# Altium schematic sheet 1.SchDoc
size C
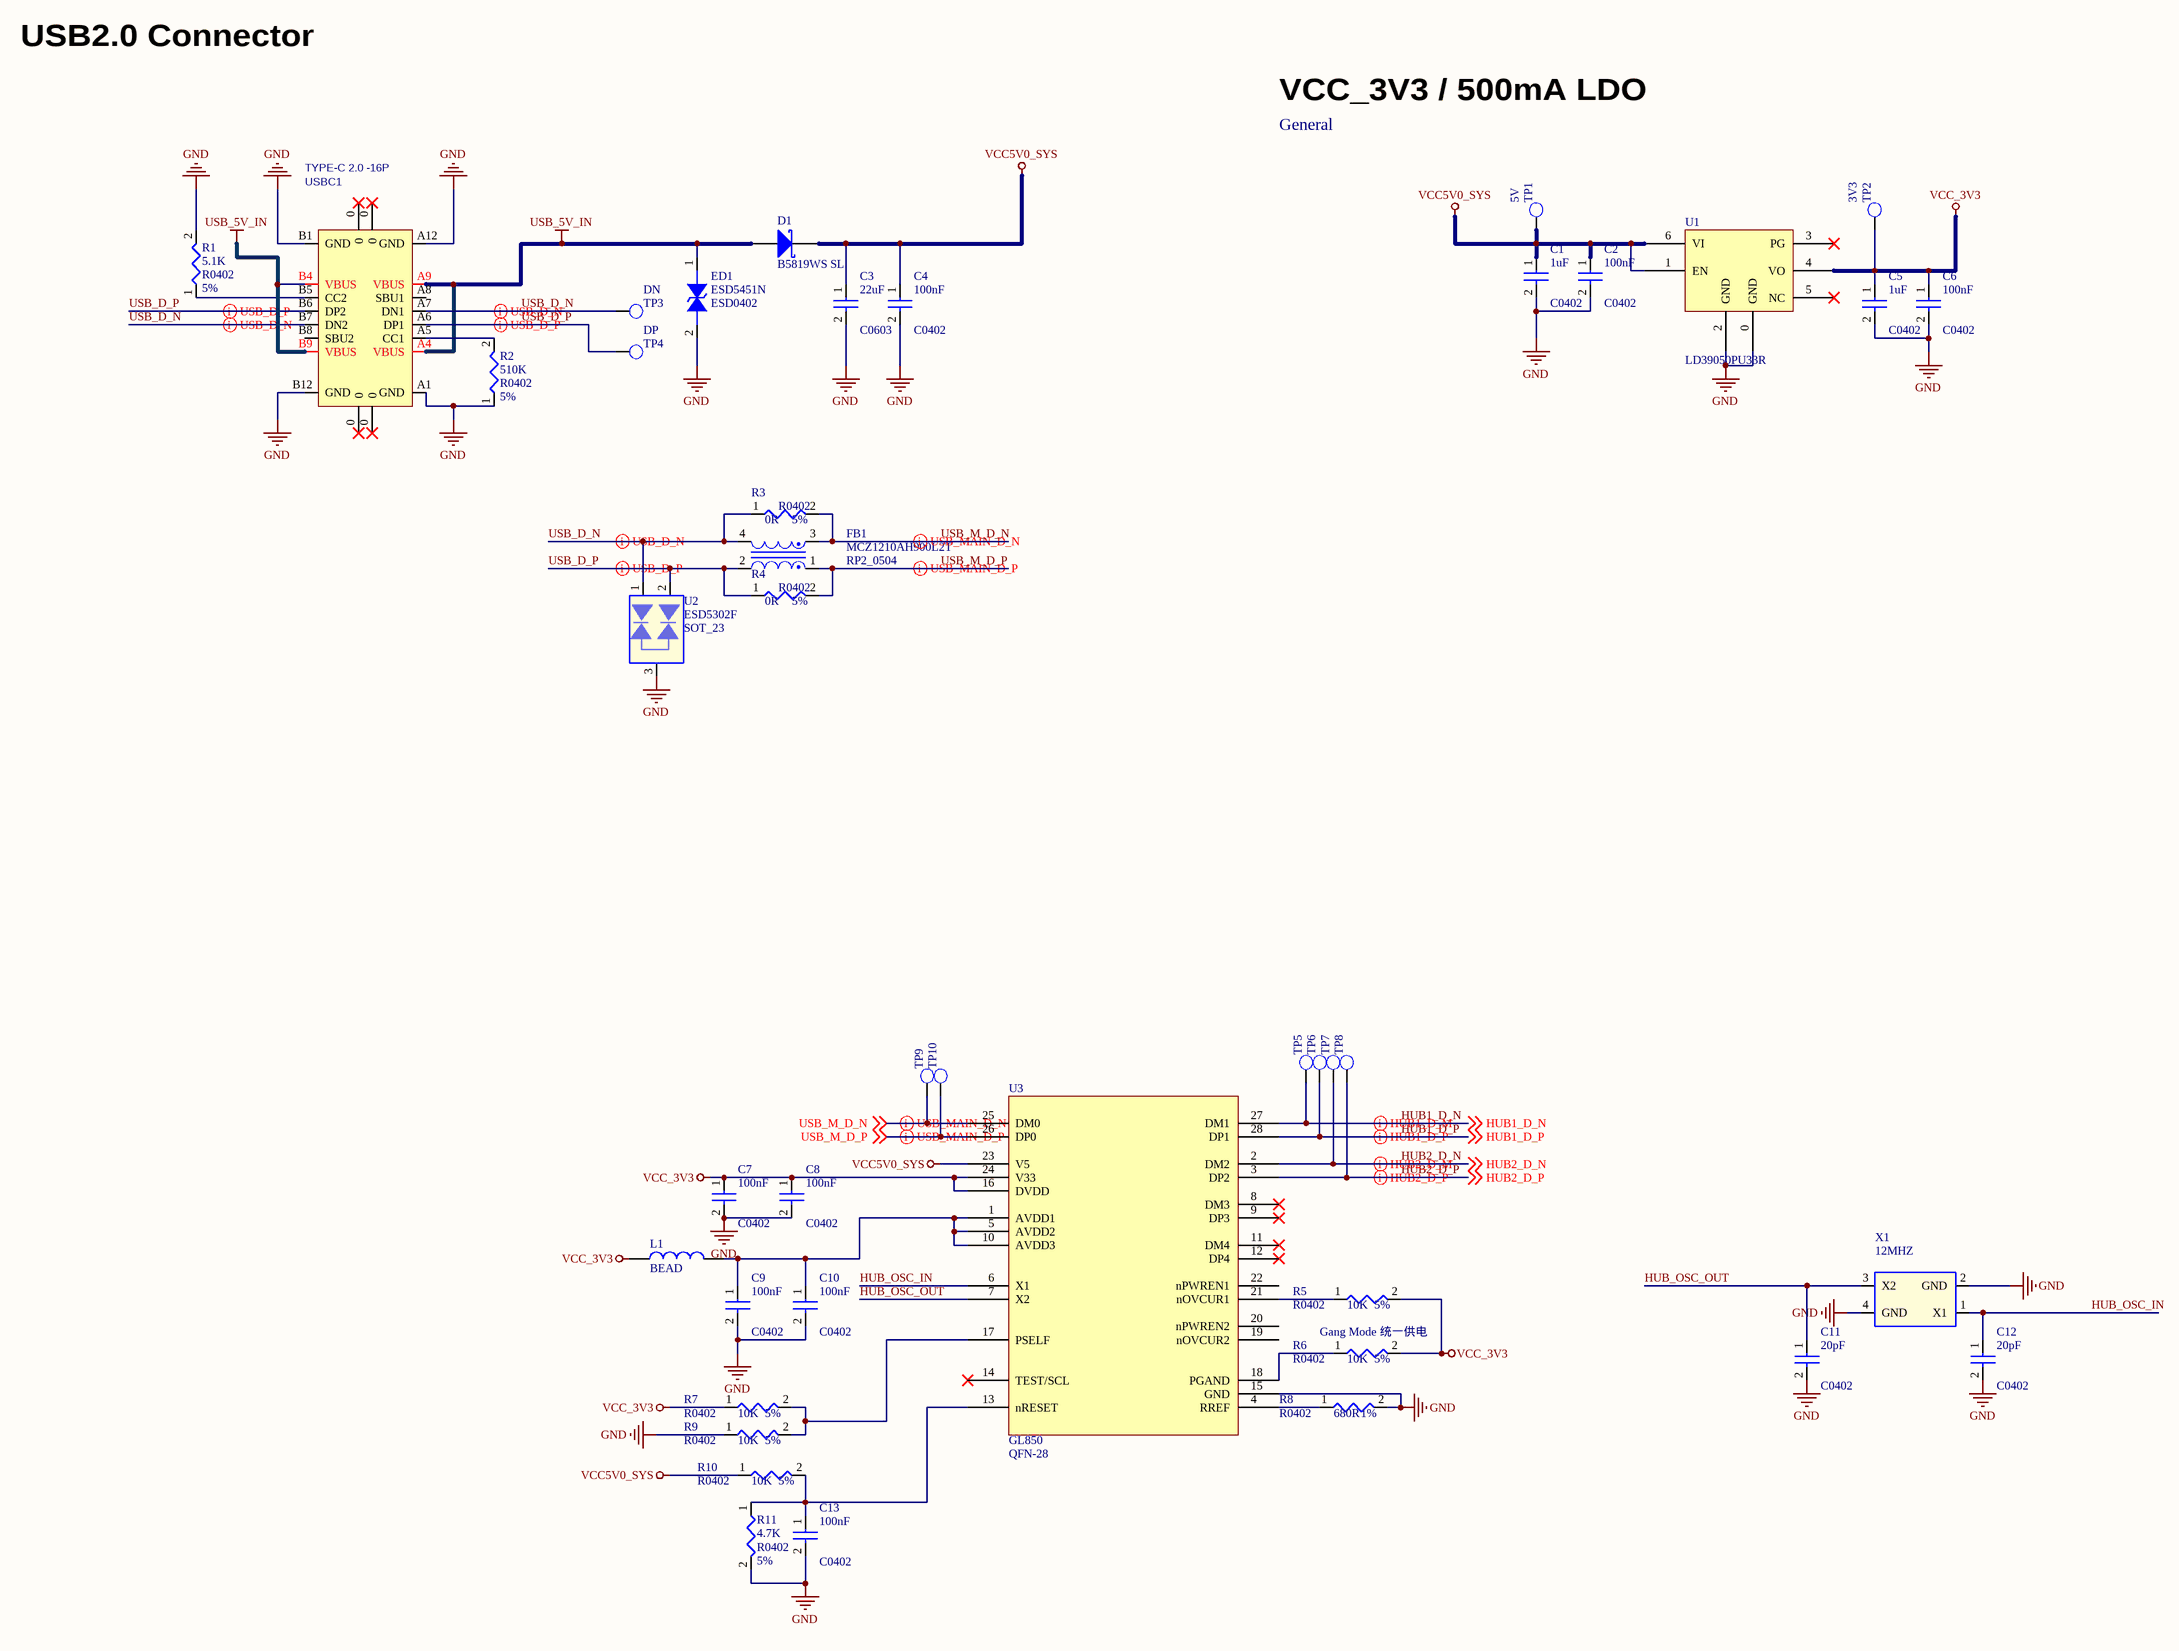
[diagram p0: 1.SchDoc]

## Parts
C1  1uF  PCB Footprint: C0402  [C0402_L]
C2  100nF  PCB Footprint: C0402  [C0402_L]
C3  22uF  PCB Footprint: C0603  [C0603_L]
C4  100nF  PCB Footprint: C0402  [C0402_L]
C5  1uF  PCB Footprint: C0402  [C0402_L]
C6  100nF  PCB Footprint: C0402  [C0402_L]
C7  100nF  PCB Footprint: C0402  [C0402_L]
C8  100nF  PCB Footprint: C0402  [C0402_L]
C9  100nF  PCB Footprint: C0402  [C0402_L]
C10  100nF  PCB Footprint: C0402  [C0402_L]
C11  20pF  PCB Footprint: C0402  [C0402_L]
C12  20pF  PCB Footprint: C0402  [C0402_L]
C13  100nF  PCB Footprint: C0402  [C0402_L]
D1  B5819WS SL  [SOD-323]
ED1  ESD5451N  [ESD0402]
FB1  MCZ1210AH900L2T  PCB Footprint: RP2_0504  [L0402D]  (net tie, no BOM)
L1  BEAD  [L0402]
R1  5.1K  Tolerance: 5%  [R0402]
R2  510K  Tolerance: 5%  [R0402]
R3  0R  Tolerance: 5%  [R0402]
R4  0R  Tolerance: 5%  [R0402]
R5  10K  Tolerance: 5%  [R0402]
R6  10K  Tolerance: 5%  [R0402]
R7  10K  Tolerance: 5%  [R0402]
R8  680R  Tolerance: 1%  [R0402]
R9  10K  Tolerance: 5%  [R0402]
R10  10K  Tolerance: 5%  [R0402]
R11  4.7K  Tolerance: 5%  [R0402]
TP1  5V  [TP_0R70]  (no BOM)
TP2  3V3  [TP_0R70]  (no BOM)
TP3  DN  [TP_0R70]  (no BOM)
TP4  DP  [TP_0R70]  (no BOM)
TP5  (no value)  [TP_0R70]  (no BOM)
TP6  (no value)  [TP_0R70]  (no BOM)
TP7  (no value)  [TP_0R70]  (no BOM)
TP8  (no value)  [TP_0R70]  (no BOM)
TP9  (no value)  [TP_0R70]  (no BOM)
TP10  (no value)  [TP_0R70]  (no BOM)
U1  LD39050PU33R  [SON95P300X300X100-7N]
U2  ESD5302F  PCB Footprint: SOT_23  [SOT23]
U3  GL850  [QFN-28]
USBC1  TYPE-C 2.0 -16P  [USB-C-SMD_16P]
X1  12MHZ  [XTAL_3225]

## Nets
GND: C1.2 C2.2 C3.2 C4.2 C5.2 C6.2 C7.2 C8.2 C9.2 C10.2 C11.2 C12.2 C13.2 ED1.2 R1.2 R2.1 R8.2 R9.1 R11.2 U1.0(GND) U1.2(GND) U2.3 U3.15(GND) USBC1.A1(GND) USBC1.A12(GND) USBC1.B1(GND) USBC1.B12(GND) X1.2(GND) X1.4(GND)
USB_5V_IN: D1.1(A) ED1.1 USBC1.A4(VBUS) USBC1.A9(VBUS) USBC1.B4(VBUS) USBC1.B9(VBUS)
VCC5V0_SYS: C1.1 C2.1 C3.1 C4.1 D1.2(K) R10.1 TP1.1 U1.1(EN) U1.6(VI) U3.23(V5)
VCC_3V3: C5.1 C6.1 C7.1 C8.1 L1.1 R5.2 R6.2 R7.1 TP2.1 U1.4(VO) U3.16(DVDD) U3.24(V33)
HUB1_D_N: TP5.1 U3.27(DM1) ; off-sheet HUB1_D_N
HUB1_D_P: TP6.1 U3.28(DP1) ; off-sheet HUB1_D_P
HUB2_D_N: TP7.1 U3.2(DM2) ; off-sheet HUB2_D_N
HUB2_D_P: TP8.1 U3.3(DP2) ; off-sheet HUB2_D_P
HUB_OSC_IN: C12.1 U3.6(X1) X1.1(X1)
HUB_OSC_OUT: C11.1 U3.7(X2) X1.3(X2)
USB_D_N: FB1.4 R3.1 TP3.1 U2.1 USBC1.A7(DN1) USBC1.B7(DN2)
USB_D_P: FB1.2 R4.1 TP4.1 U2.2 USBC1.A6(DP1) USBC1.B6(DP2)
USB_M_D_N: FB1.3 R3.2 TP9.1 U3.25(DM0) ; off-sheet USB_M_D_N
USB_M_D_P: FB1.1 R4.2 TP10.1 U3.26(DP0) ; off-sheet USB_M_D_P
NetC9_1: C9.1 C10.1 L1.2 U3.1(AVDD1) U3.5(AVDD2) U3.10(AVDD3)
NetC13_1: C13.1 R10.2 R11.1 U3.13(nRESET)
NetR1_1: R1.1 USBC1.B5(CC2)
NetR2_2: R2.2 USBC1.A5(CC1)
NetR5_1: R5.1 U3.21(nOVCUR1)
NetR6_1: R6.1 U3.18(PGAND)
NetR7_2: R7.2 R9.2 U3.17(PSELF)
NetR8_1: R8.1 U3.4(RREF)

Not connected (* = marked no-connect by the designer): U1 3(PG)* 5(NC)*; U3 8(DM3)* 9(DP3)* 11(DM4)* 12(DP4)* 14(TEST/SCL)* 19(nOVCUR2) 20(nPWREN2) 22(nPWREN1); USBC1 0* A8(SBU1) B8(SBU2)

## Layout directives
differential pair; differential pair class USB: HUB1_D_N, HUB1_D_P, HUB2_D_N, HUB2_D_P, USB_D_N, USB_D_P, USB_M_D_N, USB_M_D_P
differential pair; differential pair class USB; net class USB: USB_D_N, USB_D_P

## Notes on the sheet
- USB2.0 Connector
- VCC_3V3 / 500mA LDO
- General
- (near R6) Gang Mode 统一供电

## Library data of the parts
C1 C5 = CAP NP_Dup1: cap,1.0uF,+/-10%,6.3V,X5R,C0402; Manufacturer_Name: Open/Any; Priority: A; Part Type: Capacitor; Package: 0402; Manufacturer_Part_Number: Open/Any
C2 C6 = CAP NP_Dup1: cap,1.0uF,+/-10%,6.3V,C0402; Manufacturer_Name: Open/Any; Priority: A; Part Type: Capacitor; Package: 0402; Manufacturer_Part_Number: Open/Any
C3 = CAP NP_Dup1: cap,22.00uF,+/-10%,10V,X5R,C0603; Manufacturer_Name: Open/Any; Priority: A; Part Type: Capacitor; Package: 0603; Manufacturer_Part_Number: Open/Any
C4 C7-C10 C13 = CAP NP_Dup1: cap,100.00nF,+/-10%,10V,X5R,C0402; Manufacturer_Name: Open/Any; Priority: A; Part Type: Capacitor; Package: 0402; Manufacturer_Part_Number: Open/Any
C11 C12 = CAP NP_Dup1: cap,20pF,+/-10%,25V,X5R,C0402; Manufacturer_Name: Open/Any; Priority: A; Part Type: Capacitor; Package: 0402; Manufacturer_Part_Number: Open/Any
D1 = SS14: B5819WS SL 肖特基二极管 / SOD-323; Manufacturer_Name: MDD; Part Type: Diode; Package: SOD-323; Manufacturer_Part_Number: B5819WS SL
ED1 = DIODE BI_DIR TRIG: 1-Line, Bi-directional, Transient Voltage Suppressors.17.5pF.; Manufacturer_Name: Will Semiconductor Ltd.; Priority: A; PCB Footprint: ESD0402; Part Type: ESD_TVS; Manufacturer_Part_Number: ESD5451N; Package: 0402
FB1 = INDUCTOR COM: MCZ1210AH900L2T, 0603 90Ohm 100MHz; Manufacturer_Name: TDK; Priority: A; Part Type: BEAD; Manufacturer_Part_Number: MCZ1210AH900L2T; Package: 0504
L1 = L-AL: 鐵氧體磁珠 33ohm 0.55A 550mOhms 0402 Chip Bead; Manufacturer_Name: TDK; Manufacturer_Part_Number: MPZ0402S330CTF0W; PCB Footprint: 0402; Part Type: BEAD; Package: 0402
R1 = RESISTOR: 通用厚膜电阻,5.1K,+/-5%,R0402; Manufacturer_Name: Open/Any; Priority: A; PCB Footprint: R0402; Part Type: Resistor; Package: 0402; Manufacturer_Part_Number: Open/Any
R2 = RESISTOR: 通用厚膜电阻,510K,+/-1%,R0402; Manufacturer_Name: Open/Any; Priority: A; PCB Footprint: R0402; Part Type: Resistor; Package: 0402; Manufacturer_Part_Number: Open/Any
R3 R4 = RESISTOR: 通用厚膜电阻,0R,+/-5%,R0402; Manufacturer_Name: Open/Any; Priority: A; PCB Footprint: R0402; Part Type: Resistor; Package: 0402; Manufacturer_Part_Number: Open/Any
R5-R7 R9 R10 = RESISTOR: 通用厚膜电阻,10K,+/-5%,R0402; Manufacturer_Name: Open/Any; Priority: A; PCB Footprint: R0402; Part Type: Resistor; Package: 0402; Manufacturer_Part_Number: Open/Any
R8 = RESISTOR: 通用厚膜电阻,680R,+/-1%,R0402; Manufacturer_Name: Open/Any; Priority: A; PCB Footprint: R0402; Part Type: Resistor; Package: 0402; Manufacturer_Part_Number: Open/Any
R11 = RESISTOR: 通用厚膜电阻,4.7K,+/-5%,R0402; Manufacturer_Name: Open/Any; Priority: A; PCB Footprint: R0402; Part Type: Resistor; Package: 0402; Manufacturer_Part_Number: Open/Any
TP1-TP10 = TP: Test Point 0.7mm; PCB Footprint: TP_0R50; Priority: A; Part Type: TP
U1 = LD39050PU33R: LD39050PU33R / 6-DFN (3x3) / Output 500mA; Manufacturer_Name: STMicroelectronics; PCB Footprint: DFN-6; Manufacturer_Part_Number: LD39050PU33R; Package: DFN-6; Part Type: LDO
U2 = ESD_ESDA6V8UL: 2-Lines, Uni-directional,Ultra-low Capacitance.Transient Voltage Suppressors; Manufacturer_Name: Will Semiconductor Ltd.; Priority: A; Part Type: ESD_TVS; Manufacturer_Part_Number: ESD5302F; Package: SOT-23
U3 = GL850G: GL850 4 Port USB HUB QFN-28; Manufacturer_Name: Genesys Logic, Inc.; Manufacturer_Part_Number: GL850G-OHYXX; Package: QFN-28; Part Type: IC; PCB Footprint: QFN-28
USBC1 = USB2.0_Type-C_16Pin: USB2.0_Type-C_16Pin母座; Manufacturer_Name: SUNFUN/ Global Connector Technology; Manufacturer_Part_Number: MCCF-R1N1/USB4105-15-A-120; Part Type: USB Connector
X1 = CRYSTAL_4P: 12MHZ (16pF), 3.2 mm x 2.5 mm / 无源晶振(谐振器）; Manufacturer_Name: Open/Any; Manufacturer_Part_Number: Open/Any